# EAGLE design progshield (EAGLE 7.4.0)
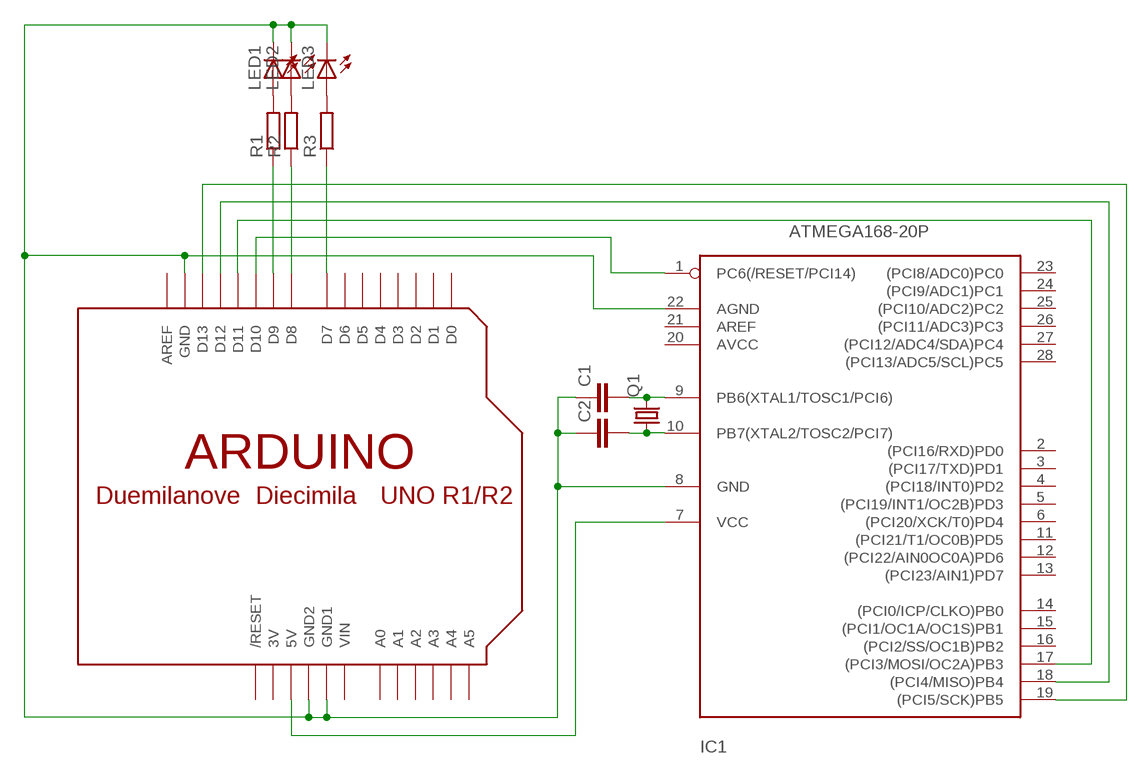
[diagram p0: schematic, sheet 1]

## Parts
C1  C-EU025-030X050  [C025-030X050]
C2  C-EU025-030X050  [C025-030X050]
IC1  ATMEGA168-20P  [DIL28-3]
LED1  LED3MM  [LED3MM]
LED2  LED3MM  [LED3MM]
LED3  LED3MM  [LED3MM]
Q1  CRYSTALHC49S  [HC49/S]
R1  R-EU_0204/7  [0204/7]
R2  R-EU_0204/7  [0204/7]
R3  R-EU_0204/7  [0204/7]
U$1  ARDUINOUNO  [ARDUINO]

## Nets
N$1: IC1.7(VCC) U$1.5V
N$2: IC1.1(PC6(/RESET/PCI14)) U$1.D10
N$3: C1.2 IC1.9(PB6(XTAL1/TOSC1/PCI6)) Q1.2
N$4: C2.2 IC1.10(PB7(XTAL2/TOSC2/PCI7)) Q1.1
N$7: IC1.19((PCI5/SCK)PB5) U$1.D13
N$8: IC1.18((PCI4/MISO)PB4) U$1.D12
N$9: IC1.17((PCI3/MOSI/OC2A)PB3) U$1.D11
N$10: R1.1 U$1.D9
N$11: R2.1 U$1.D8
N$12: R3.1 U$1.D7
N$13: LED3.A R3.2
N$14: LED2.A R2.2
N$15: LED1.A R1.2
N$16: C1.1 C2.1 IC1.8(GND) IC1.22(AGND) LED1.K(C) LED2.K(C) LED3.K(C) U$1.GND U$1.GND1 U$1.GND2
Unconnected: IC1.2((PCI16/RXD)PD0) IC1.3((PCI17/TXD)PD1) IC1.4((PCI18/INT0)PD2) IC1.5((PCI19/INT1/OC2B)PD3) IC1.6((PCI20/XCK/T0)PD4) IC1.11((PCI21/T1/OC0B)PD5) IC1.12((PCI22/AIN0OC0A)PD6) IC1.13((PCI23/AIN1)PD7) IC1.14((PCI0/ICP/CLKO)PB0) IC1.15((PCI1/OC1A/OC1S)PB1) IC1.16((PCI2/SS/OC1B)PB2) IC1.20(AVCC) IC1.21(AREF) IC1.23((PCI8/ADC0)PC0) IC1.24((PCI9/ADC1)PC1) IC1.25((PCI10/ADC2)PC2) IC1.26((PCI11/ADC3)PC3) IC1.27((PCI12/ADC4/SDA)PC4) IC1.28((PCI13/ADC5/SCL)PC5) U$1.A0 U$1.A1 U$1.A2 U$1.A3 U$1.A4 U$1.A5 U$1.AREF U$1.D0 U$1.D1 U$1.D2 U$1.D3 U$1.D4 U$1.D5 U$1.D6 U$1.RESET(/RESET)

## Power pins joined to a net without a drawn wire
3V: U$1.3V
VIN: U$1.VIN

## Library data of the parts
C1 C2 = rcl:C-EU: CAPACITOR, European symbol
IC1 = adafruit:ATMEGA168*P: MICROCONTROLLER 16 kBytes FLASH 1 kBytes SRAM 512 Bytes EEPROM USART 8-channel 10 bit ADC
LED1-LED3 = adafruit:LED: LED OSRAM: - CHIPLED LG R971, LG N971, LY N971, LG Q971, LY Q971, LO R971, LY R971 LH N974, LH R974 LS Q976, LO Q976, LY Q976 LO Q996 - Hyper CHIPLED LW Q18S LB Q993, LB Q99A, LB R99A - SideLED LS A670, LO A670, LY A670, LG A670, LP A670 LB A673, LV A673, LT A673, LW A673 LH A674 LY A675 LS A676, LA A676, LO A676, LY A676, LW A676 LS A679, LY A679, LG A679 - Hyper Micro SIDELED® LS Y876, LA Y876, LO Y876, LY Y876 LT Y87S - SmartLED LW L88C, LW L88S LB L89C, LB L89S, LG L890 LS L89K, LO L89K, LY L89K LS L896, LA L896, LO L896, LY L896 - TOPLED LS T670, LO T670, LY T670, LG T670, LP T670 LSG T670, LSP T670, LSY T670, LOP T670, LYG T670 LG T671, LOG T671, LSG T671 LB T673, LV T673, LT T673, LW T673 LH T674 LS T676, LA T676, LO T676, LY T676, LB T676, LH T676, LSB T676, LW T676 LB T67C, LV T67C, LT T67C, LS T67K, LO T67K, LY T67K, LW E67C LS E67B, LA E67B, LO E67B, LY E67B, LB E67C, LV E67C, LT E67C LW T67C LS T679, LY T679, LG T679 LS T770, LO T770, LY T770, LG T770, LP T770 LB T773, LV T773, LT T773, LW T773 LH T774 LS E675, LA E675, LY E675, LS T675 LS T776, LA T776, LO T776, LY T776, LB T776 LHGB T686 LT T68C, LB T68C - Hyper Mini TOPLED® LB M676 - Mini TOPLED Santana® LG M470 LS M47K, LO M47K, LY M47K Source: http://www.osram.convergy.de/
Q1 = adafruit:CRYSTAL: CRYSTAL; OC_FARNELL: 1667008; OC_NEWARK: unknown
R1-R3 = rcl:R-EU_: RESISTOR, European symbol
U$1 = adafruit:ARDUINO: Arduino Diecimila/Duemilanove Make a shield with ease, this package has all the named pins as well as the two mounting drill holes and an outline of the USB and DC power connector. The outline is on the DIMENSION layer, so if your board house uses it they will cut the outline to match. http://www.ladyada.net/library/pcb/eaglelibrary.html

## Board
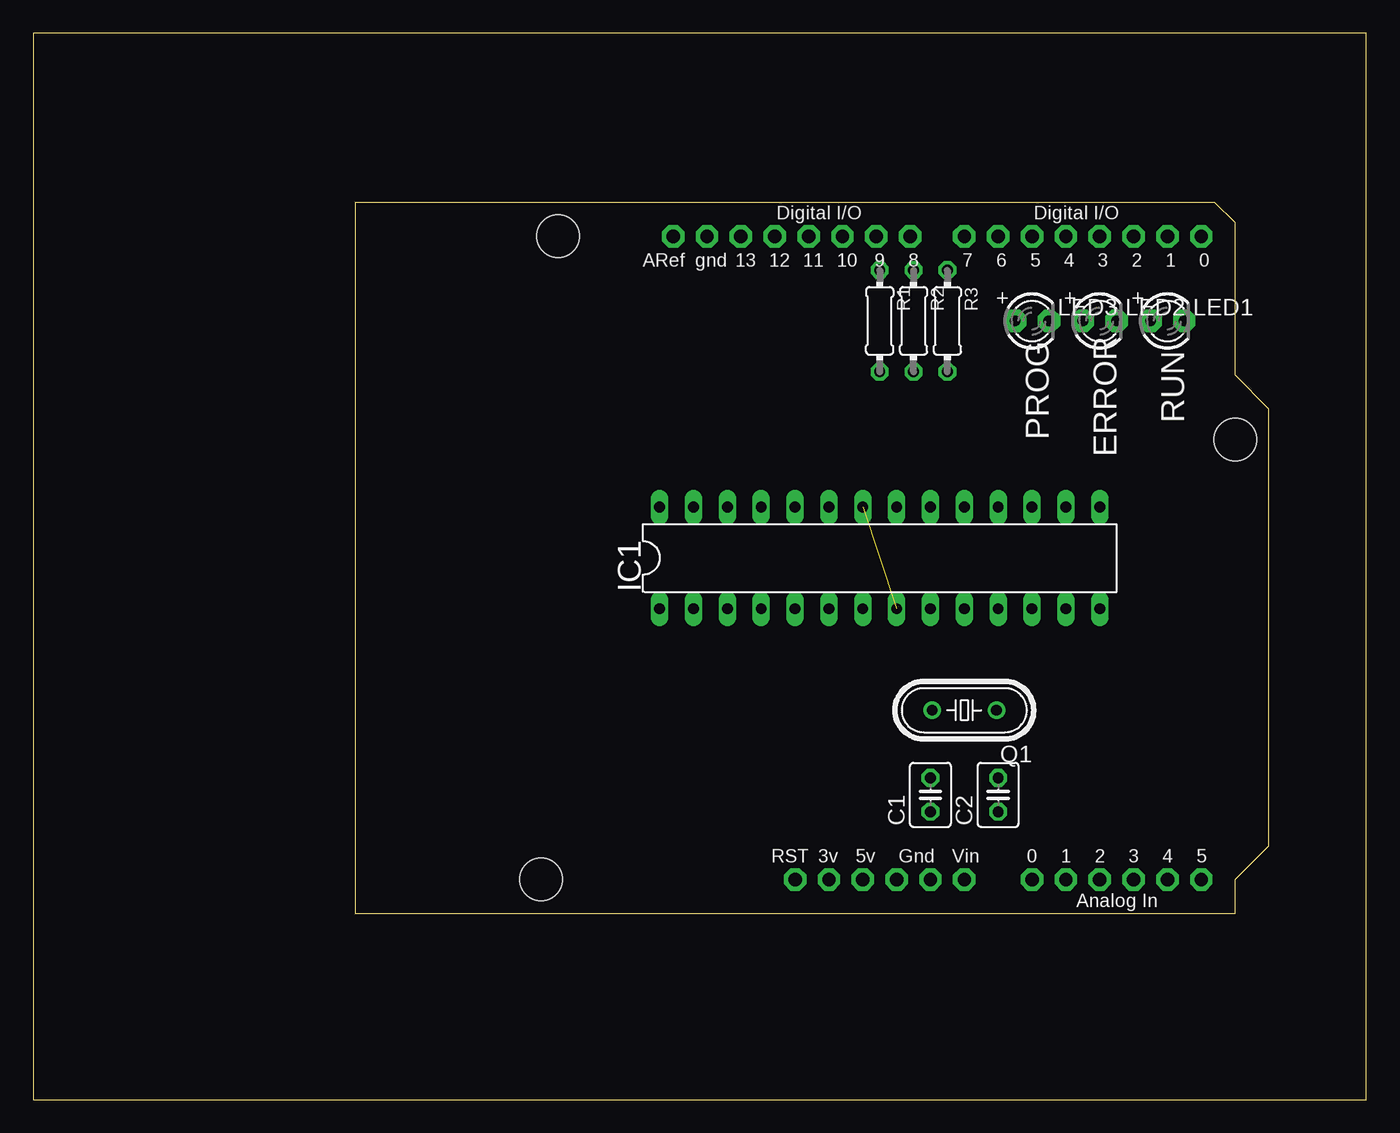
[diagram p1: board, top side]
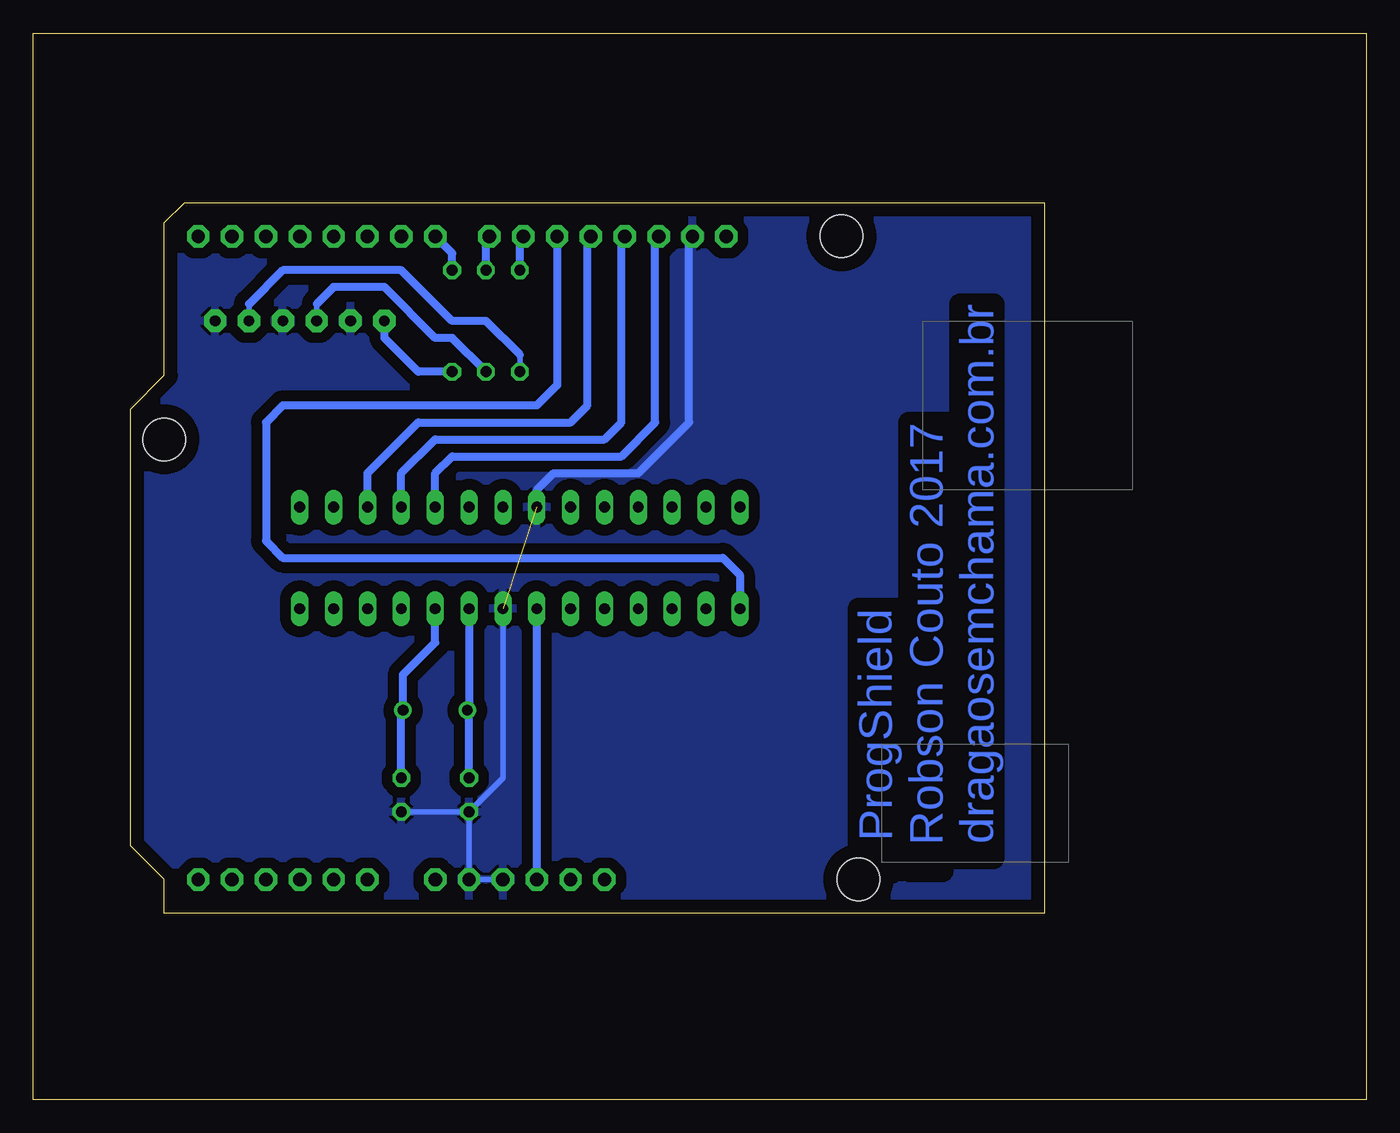
[diagram p2: board, bottom side, seen from below]

Size 100 x 80 mm. Coordinates in mm from the lower left corner, seen from the top.
Outline: 0,0 100,0 100,80 0,80 0,0
Copper layers (1*16): Top 0.035mm / dielectric 1.5mm / Bottom 0.035mm
Design rules "default *": minimum track width 10mil, minimum drill 24mil, track to track 32mil, track to pad 24mil, pad to pad 16mil, via to via 16mil, smd to smd 8mil, copper to edge 40mil, drill to drill 8mil, minimum pad ring 10mil, minimum via ring 8mil, stop-mask expansion 4mil, vias tented up to drill 0mil, thermal gap 10mil

### Footprints (pad centres in the part's own frame; a part is rotated, then mirrored left to right if it is on the bottom)
C025-030X050 = drill 0.813 octagon: 1 -1.27,0; 2 1.27,0
DIL28-3 = drill 0.813 long: 1 -16.51,-3.81; 2 -13.97,-3.81; 3 -11.43,-3.81; 4 -8.89,-3.81; 5 -6.35,-3.81; 6 -3.81,-3.81; 7 -1.27,-3.81; 8 1.27,-3.81; 9 3.81,-3.81; 10 6.35,-3.81; 11 8.89,-3.81; 12 11.43,-3.81; 13 13.97,-3.81; 14 16.51,-3.81; 15 16.51,3.81; 16 13.97,3.81; 17 11.43,3.81; 18 8.89,3.81; 19 6.35,3.81; 20 3.81,3.81; 21 1.27,3.81; 22 -1.27,3.81; 23 -3.81,3.81; 24 -6.35,3.81; 25 -8.89,3.81; 26 -11.43,3.81; 27 -13.97,3.81; 28 -16.51,3.81
LED3MM = drill 0.813 pad 1.676 octagon: A -1.27,0; K 1.27,0
HC49/S = drill 0.813: 1 -2.413,0; 2 2.413,0
0204/7 = drill 0.813 octagon: 1 -3.81,0; 2 3.81,0
ARDUINO = drill 1 pad 1.676 octagon: 3V 35.56,2.54; 5V 38.1,2.54; A0 50.8,2.54; A1 53.34,2.54; A2 55.88,2.54; A3 58.42,2.54; A4 60.96,2.54; A5 63.5,2.54; AREF 23.876,50.8; D0 63.5,50.8; D1 60.96,50.8; D2 58.42,50.8; D3 55.88,50.8; D4 53.34,50.8; D5 50.8,50.8; D6 48.26,50.8; D7 45.72,50.8; D8 41.656,50.8; D9 39.116,50.8; D10 36.576,50.8; D11 34.036,50.8; D12 31.496,50.8; D13 28.956,50.8; GND 26.416,50.8; GND1 43.18,2.54; GND2 40.64,2.54; RESET 33.02,2.54; VIN 45.72,2.54 | hole 3.2: 15.24,50.8; 66.04,35.56; 13.97,2.54

### Placement (x,y rotation side)
C1  67.31,22.86 90 top
C2  72.39,22.86 90 top
IC1  63.5,40.64 0 top
LED1  85.09,58.42 0 top
LED2  80.01,58.42 0 top
LED3  74.93,58.42 0 top
Q1  69.85,29.21 180 top
R1  63.5,58.42 270 top
R2  66.04,58.42 270 top
R3  68.58,58.42 270 top
U$1  24.13,13.97 0 top

### Tracks (layer width: path | path; a pad name or v marks a point on that pad's centre or on a via)
N$1
  Bottom 0.61: IC1.7 U$1.5V
N$2
  Bottom 0.61: U$1.D10 60.71,53.59 62.23,52.07 81.28,52.07 82.55,50.8 82.55,41.91 81.28,40.64 48.26,40.64 46.99,39.37 IC1.1
N$3
  Bottom 0.61: IC1.9 67.31,29.34 Q1.2 67.31,29.08 C1.2
N$4
  Bottom 0.61: IC1.10 69.85,34.29 72.26,31.88 Q1.1 72.39,29.08 C2.2
N$7
  Bottom 0.406: 53.34,64.52 U$1.D13
  Bottom 0.61: IC1.19 69.85,46.99 68.58,48.26 55.88,48.26 53.34,50.8 53.34,64.52
N$8
  Bottom 0.406: 55.88,64.52 U$1.D12
  Bottom 0.61: 55.88,64.52 55.88,50.8 57.15,49.53 69.85,49.53 72.39,46.99 IC1.18
N$9
  Bottom 0.406: 58.42,64.52 U$1.D11
  Bottom 0.61: IC1.17 74.93,46.99 71.12,50.8 59.69,50.8 58.42,52.07 58.42,64.52
N$10
  Bottom 0.406: 63.5,64.52 U$1.D9
  Bottom 0.61: R1.1 63.5,64.52
N$11
  Bottom 0.406: 66.04,64.52 U$1.D8
  Bottom 0.61: R2.1 66.04,64.52
N$12
  Bottom 0.61: R3.1 68.58,63.5 U$1.D7
N$13
  Bottom 0.61: R3.2 71.12,54.61 73.66,57.15 LED3.A
N$14
  Bottom 0.406: 78.74,59.69 LED2.A
  Bottom 0.61: R2.2 68.58,57.15 69.85,57.15 73.66,60.96 77.47,60.96 78.74,59.69
N$15
  Bottom 0.406: R1.2 63.5,55.88 | 83.82,59.69 LED1.A
  Bottom 0.61: 63.5,55.88 66.04,58.42 68.58,58.42 72.39,62.23 81.28,62.23 83.82,59.69
N$16  (1 unrouted)
  Bottom 0.406: 50.8,64.52 U$1.GND | U$1.GND2 U$1.GND1 C1.1 | C1.1 C2.1 | C1.1 64.77,24.13 IC1.8
  Bottom 0.61: IC1.22 62.23,45.72 60.96,46.99 54.61,46.99 50.8,50.8 50.8,64.52
  pour Bottom: 24.13,68.58 24.13,12.7 90.17,12.7 90.17,16.51 92.71,19.05 92.71,52.07 90.17,54.61 90.17,66.04 87.63,68.58

### Text on the board
Bottom: dragaosemchama.com.br | Robson Couto 2017 | ProgShield
tNames: RUN | PROG | ERROR